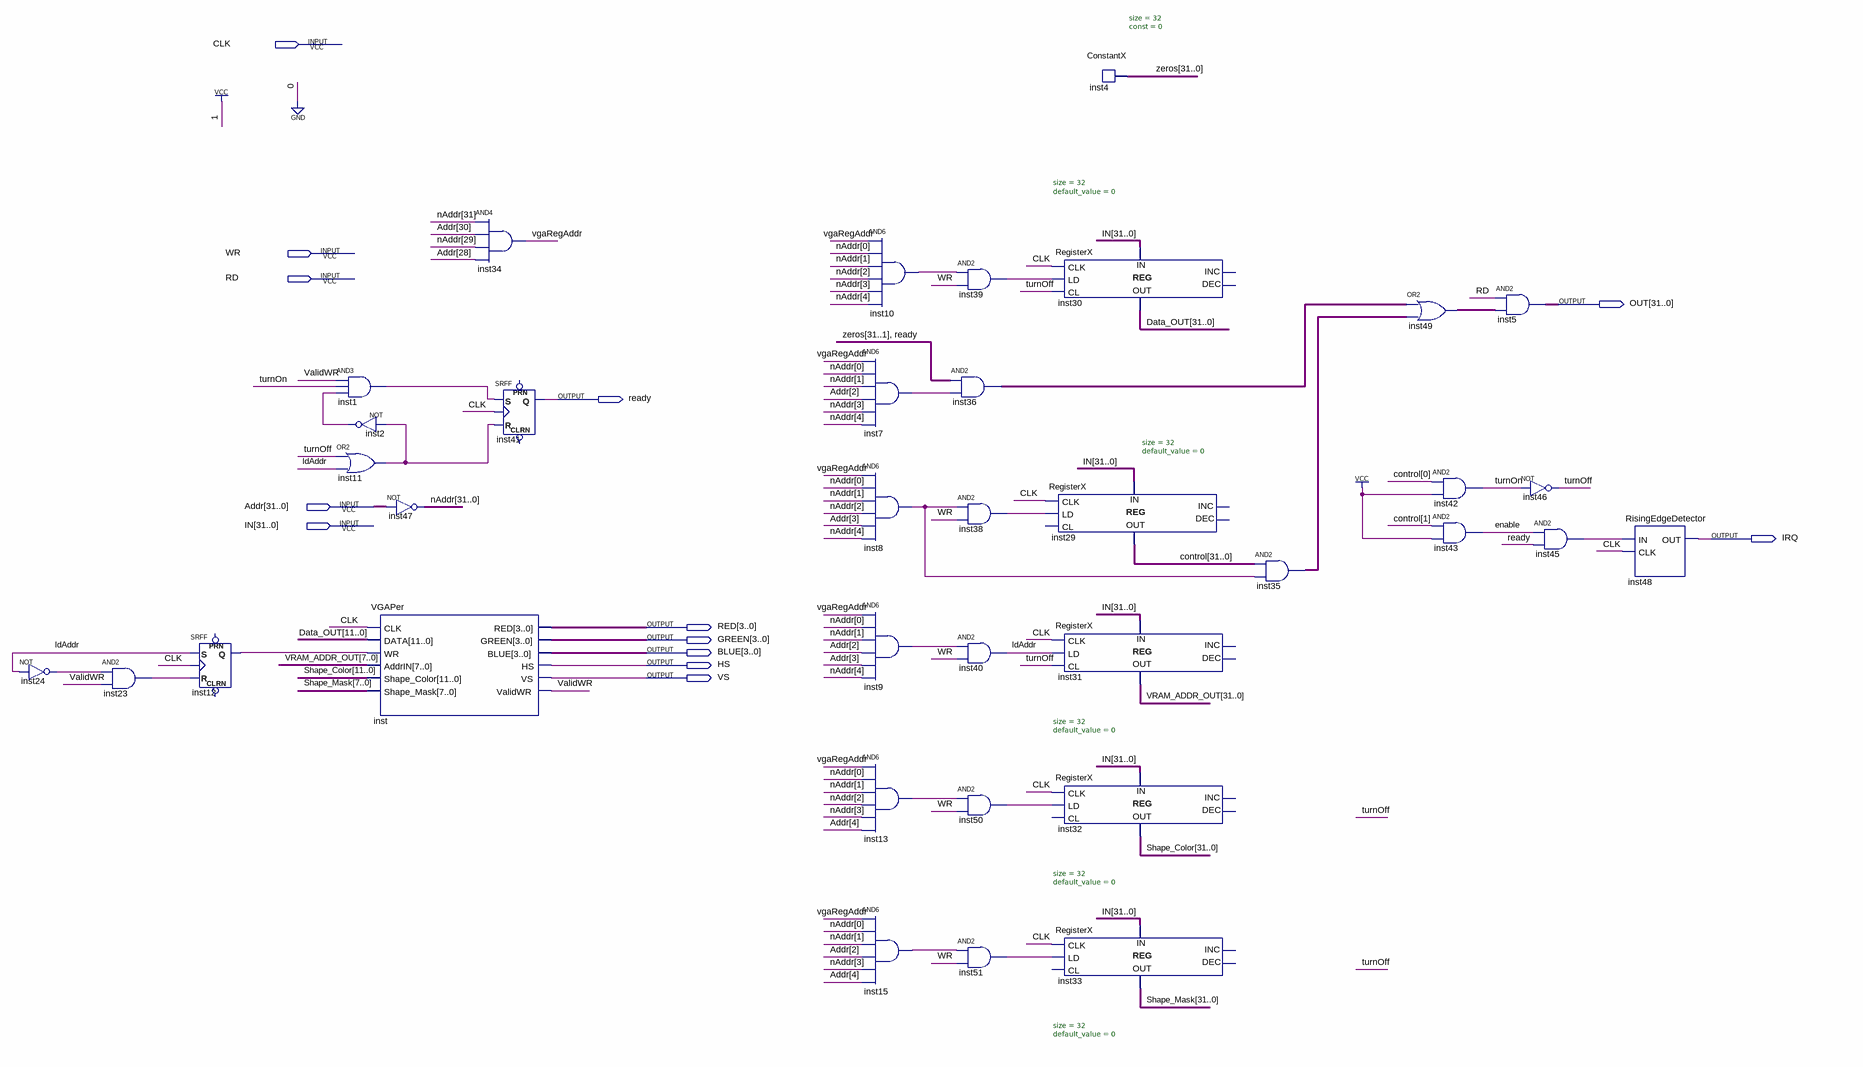
[diagram p0: schematic sheet]
// Quartus schematic KPVGA.bdf as structural Verilog: 36 symbols, 13 pins
module KPVGA (
  input  CLK,
  input  WR,
  input  RD,
  input  [31:0] Addr,
  input  [31:0] IN,
  output [31:0] OUT,
  output ready,
  output IRQ,
  output [3:0] RED,
  output [3:0] GREEN,
  output [3:0] BLUE,
  output HS,
  output VS
);

  wire enable, inst1_out, inst2_out, inst7_out, inst8_out, inst9_out, inst10_out, inst11_out, inst12_q,
       inst13_out, inst15_out, inst23_out, inst24_out, inst38_out, inst39_out, inst45_out, inst50_out,
       inst51_out, ldAddr, turnOff, turnOn, ValidWR, vgaRegAddr;
  wire [31:0] control, Data_OUT, inst35_out, inst36_out, inst49_out, nAddr, Shape_Color, Shape_Mask,
       VRAM_ADDR_OUT, zeros;

  not inst24 (inst24_out, ldAddr);
  and inst23 (inst23_out, inst24_out, ValidWR);
  SRFF inst12 (.S(ldAddr), .R(inst23_out), .CLK(CLK), .Q(inst12_q));  // open: PRN, CLRN
  and inst1 (inst1_out, ValidWR, turnOn, inst2_out);
  not inst2 (inst2_out, inst11_out);
  or inst11 (inst11_out, turnOff, ldAddr);
  VGAPer inst (
    .CLK(CLK), .DATA(Data_OUT[11:0]), .WR(inst12_q), .AddrIN(VRAM_ADDR_OUT[7:0]),
    .Shape_Color(Shape_Color[11:0]), .Shape_Mask(Shape_Mask[7:0]), .RED(RED), .GREEN(GREEN), .BLUE(BLUE),
    .HS(HS), .VS(VS), .ValidWR(ValidWR));
  assign nAddr = ~Addr;  // NOT inst47, 32 bits wide
  and inst34 (vgaRegAddr, nAddr[31], Addr[30], nAddr[29], Addr[28]);
  SRFF inst41 (.S(inst1_out), .R(inst11_out), .CLK(CLK), .Q(ready));  // open: PRN, CLRN
  and inst10 (inst10_out, vgaRegAddr, nAddr[0], nAddr[1], nAddr[2], nAddr[3], nAddr[4]);
  and inst7 (inst7_out, vgaRegAddr, nAddr[0], nAddr[1], Addr[2], nAddr[3], nAddr[4]);
  and inst8 (inst8_out, vgaRegAddr, nAddr[0], nAddr[1], nAddr[2], Addr[3], nAddr[4]);
  and inst9 (inst9_out, vgaRegAddr, nAddr[0], nAddr[1], Addr[2], Addr[3], nAddr[4]);
  and inst13 (inst13_out, vgaRegAddr, nAddr[0], nAddr[1], nAddr[2], nAddr[3], Addr[4]);
  and inst15 (inst15_out, vgaRegAddr, nAddr[0], nAddr[1], Addr[2], nAddr[3], Addr[4]);
  and inst39 (inst39_out, inst10_out, WR);
  assign inst36_out = {zeros[31:1], ready} & {32{inst7_out}};  // AND2 inst36, 32 bits wide
  and inst38 (inst38_out, inst8_out, WR);
  and inst40 (ldAddr, inst9_out, WR);
  and inst50 (inst50_out, inst13_out, WR);
  and inst51 (inst51_out, inst15_out, WR);
  ConstantX #(.size(32), .\const (0)) inst4 (.DATA_OUT(zeros));
  RegisterX #(.size(32), .default_value(0)) inst30 (
    .CLK(CLK), .LD(inst39_out), .CL(turnOff), .DATA_IN(IN), .DATA_OUT(Data_OUT));  // open: INC, DEC
  RegisterX #(.size(32), .default_value(0)) inst29 (
    .CLK(CLK), .LD(inst38_out), .DATA_IN(IN), .DATA_OUT(control));  // open: CL, INC, DEC
  RegisterX #(.size(32), .default_value(0)) inst31 (
    .CLK(CLK), .LD(ldAddr), .CL(turnOff), .DATA_IN(IN), .DATA_OUT(VRAM_ADDR_OUT));  // open: INC, DEC
  RegisterX #(.size(32), .default_value(0)) inst32 (
    .CLK(CLK), .LD(inst50_out), .DATA_IN(IN), .DATA_OUT(Shape_Color));  // open: CL, INC, DEC
  RegisterX #(.size(32), .default_value(0)) inst33 (
    .CLK(CLK), .LD(inst51_out), .DATA_IN(IN), .DATA_OUT(Shape_Mask));  // open: CL, INC, DEC
  assign inst35_out = control & {32{inst8_out}};  // AND2 inst35, 32 bits wide
  assign inst49_out = inst36_out | inst35_out;  // OR2 inst49, 32 bits wide
  and inst42 (turnOn, control[0], 1'b1);
  and inst43 (enable, control[1], 1'b1);
  assign OUT = {32{RD}} & inst49_out;  // AND2 inst5, 32 bits wide
  not inst46 (turnOff, turnOn);
  and inst45 (inst45_out, enable, ready);
  RisingEdgeDetector inst48 (.IN(inst45_out), .CLK(CLK), .OUT(IRQ));
endmodule
